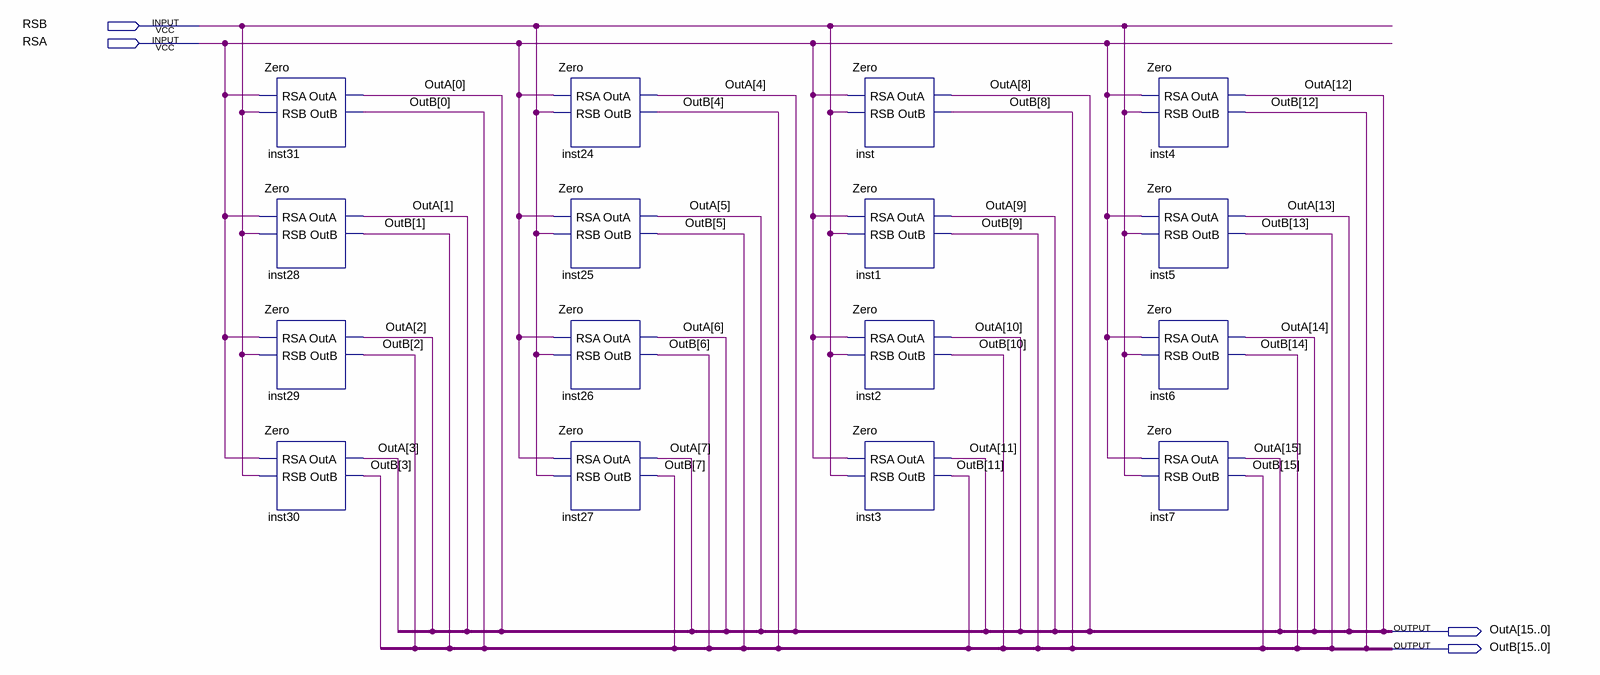
[diagram p0: schematic sheet]
// Quartus schematic Zero16.bdf as structural Verilog: 16 symbols, 4 pins
module Zero16 (
  input  RSB,
  input  RSA,
  output [15:0] OutA,
  output [15:0] OutB
);

  Zero inst31 (.RSA(RSA), .RSB(RSB), .OutA(OutA[0]), .OutB(OutB[0]));
  Zero inst28 (.RSA(RSA), .RSB(RSB), .OutA(OutA[1]), .OutB(OutB[1]));
  Zero inst29 (.RSA(RSA), .RSB(RSB), .OutA(OutA[2]), .OutB(OutB[2]));
  Zero inst30 (.RSA(RSA), .RSB(RSB), .OutA(OutA[3]), .OutB(OutB[3]));
  Zero inst24 (.RSA(RSA), .RSB(RSB), .OutA(OutA[4]), .OutB(OutB[4]));
  Zero inst25 (.RSA(RSA), .RSB(RSB), .OutA(OutA[5]), .OutB(OutB[5]));
  Zero inst26 (.RSA(RSA), .RSB(RSB), .OutA(OutA[6]), .OutB(OutB[6]));
  Zero inst27 (.RSA(RSA), .RSB(RSB), .OutA(OutA[7]), .OutB(OutB[7]));
  Zero inst (.RSA(RSA), .RSB(RSB), .OutA(OutA[8]), .OutB(OutB[8]));
  Zero inst1 (.RSA(RSA), .RSB(RSB), .OutA(OutA[9]), .OutB(OutB[9]));
  Zero inst2 (.RSA(RSA), .RSB(RSB), .OutA(OutA[10]), .OutB(OutB[10]));
  Zero inst3 (.RSA(RSA), .RSB(RSB), .OutA(OutA[11]), .OutB(OutB[11]));
  Zero inst4 (.RSA(RSA), .RSB(RSB), .OutA(OutA[12]), .OutB(OutB[12]));
  Zero inst5 (.RSA(RSA), .RSB(RSB), .OutA(OutA[13]), .OutB(OutB[13]));
  Zero inst6 (.RSA(RSA), .RSB(RSB), .OutA(OutA[14]), .OutB(OutB[14]));
  Zero inst7 (.RSA(RSA), .RSB(RSB), .OutA(OutA[15]), .OutB(OutB[15]));
endmodule
